# Altium schematic sheet PPTC081LFBN-RC.SchDoc
size A; SheetNumber: 1; SheetTotal: 1
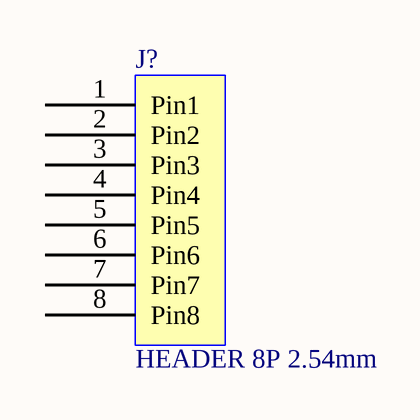
[diagram p0: PPTC081LFBN-RC.SchDoc]

## Parts
J?  HEADER 8P 2.54mm  [PPTC081LFBN-RC]

## Nets

Not connected (* = marked no-connect by the designer): J? 1(Pin1) 2(Pin2) 3(Pin3) 4(Pin4) 5(Pin5) 6(Pin6) 7(Pin7) 8(Pin8)

## Library data of the parts
J? = PPTC081LFBN-RC